# EAGLE schematic eeprom (EAGLE 6.0)
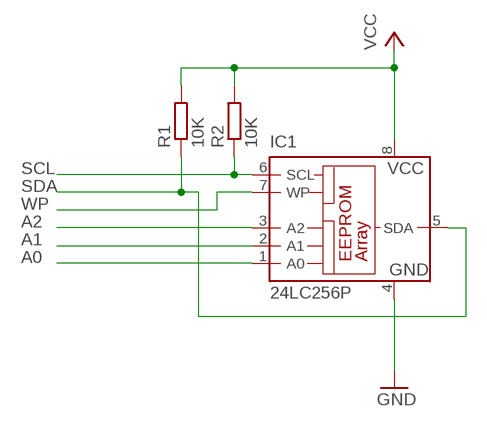
[diagram p0: schematic, sheet 1]

## Parts
IC1  24LC256P  [DIL8]
R1  10K  R-EU_0204/7  [0204/7]
R2  10K  R-EU_0204/7  [0204/7]

## Nets
A0: IC1.1(A0)
A1: IC1.2(A1)
A2: IC1.3(A2)
GND: IC1.4(GND)
SCL: IC1.6(SCL) R2.1
SDA: IC1.5(SDA) R1.1
VCC: IC1.8(VCC) R1.2 R2.2
WP: IC1.7(WP)

## Library data of the parts
IC1 = microchip:24*: Serial EEPROM I2C; MF: MICROCHIP; MPN: 24LC256-E/P; OC_FARNELL: 9757970; OC_NEWARK: 92C7169
R1 R2 = rcl:R-EU_: RESISTOR, European symbol